# EAGLE design cpod (EAGLE 6.1)
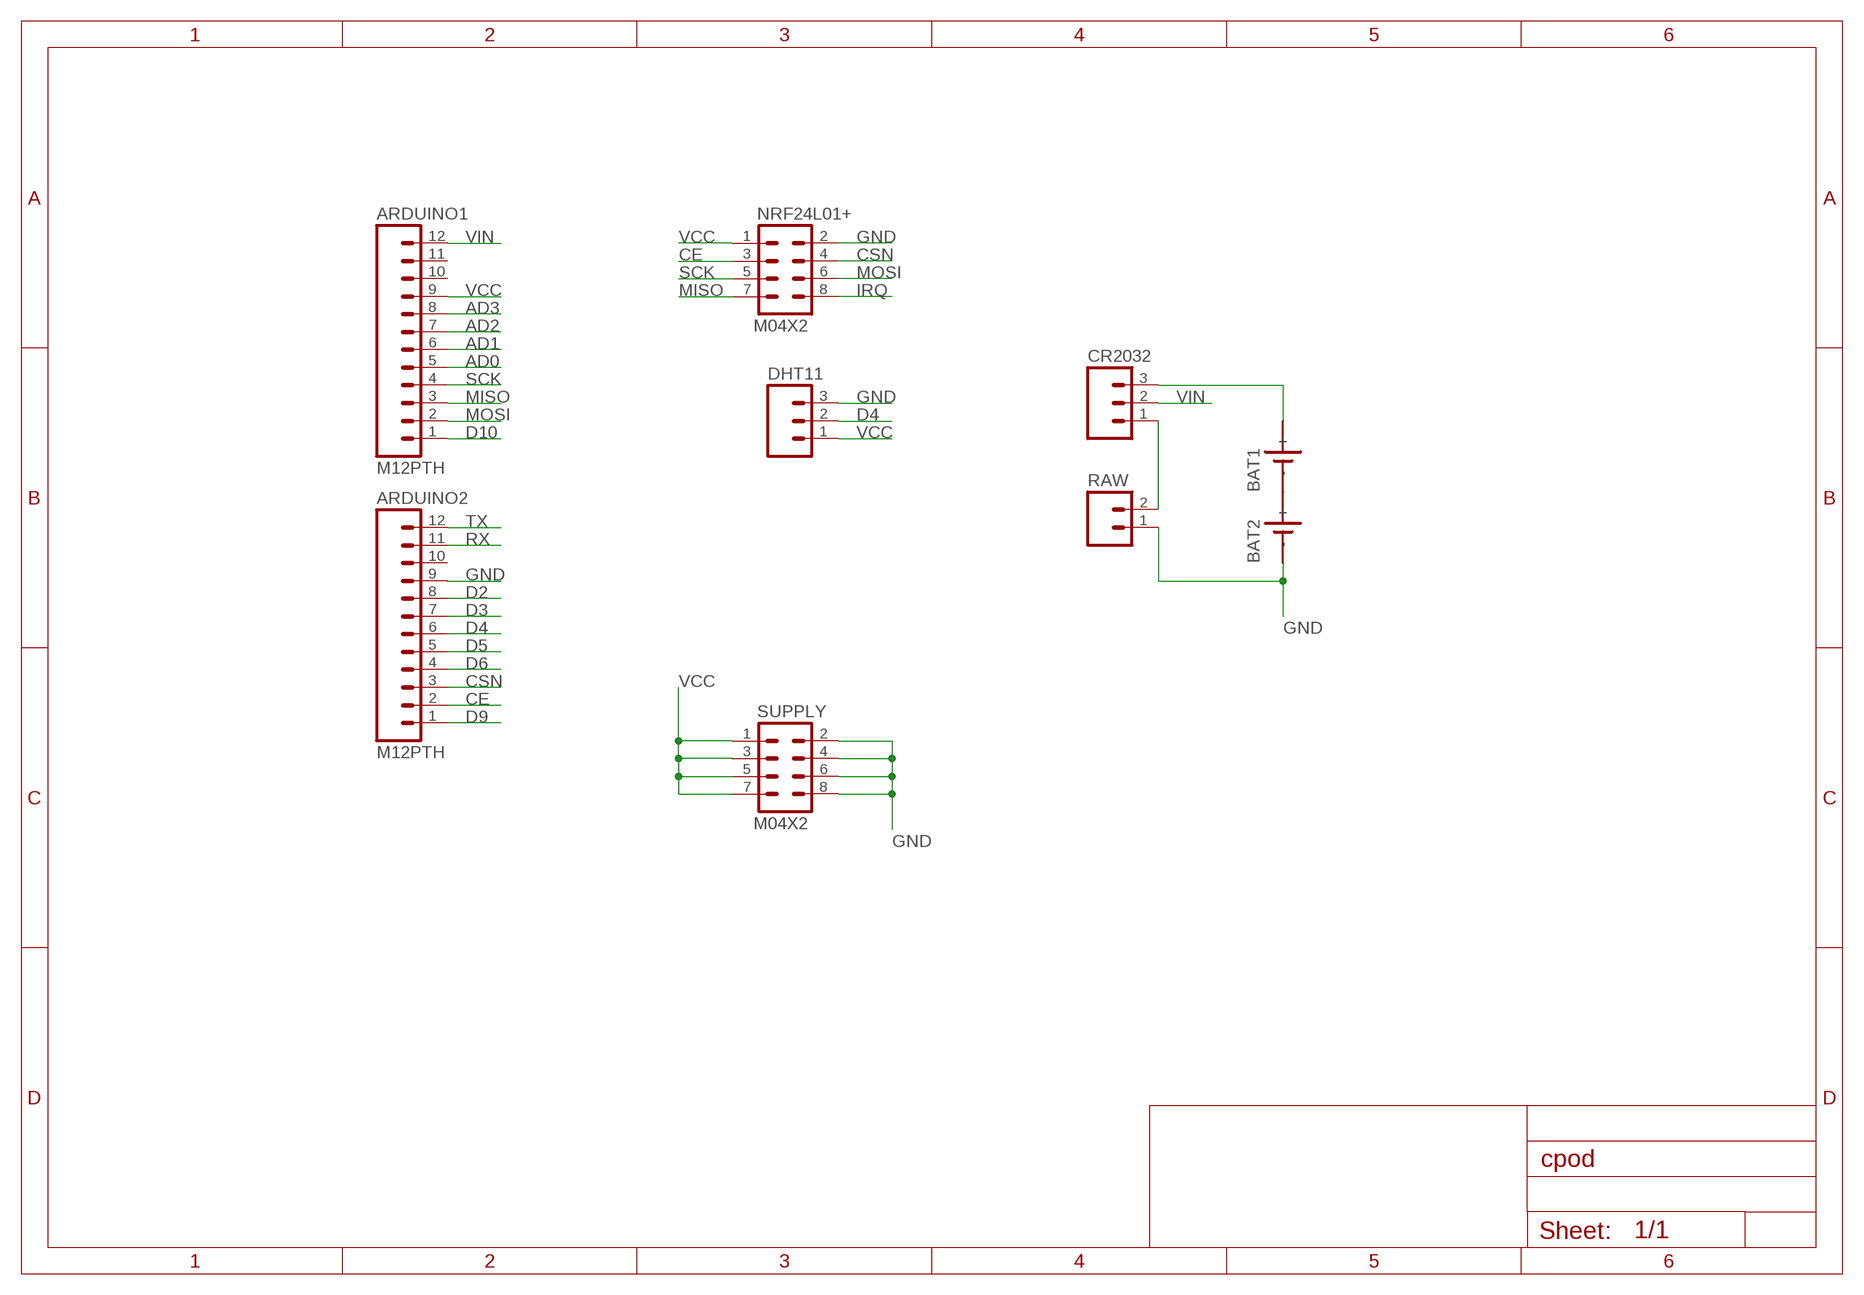
[diagram p0: schematic, sheet 1]

## Parts
ARDUINO1  M12PTH  [1X12]
ARDUINO2  M12PTH  [1X12]
BAT1  SN2032  [SN2032]
BAT2  SN2032  [SN2032]
CR2032  M03PTH  [1X03]
DHT11  M03PTH  [1X03]
NRF24L01+  M04X2  [2X4]
RAW  M02PTH  [1X02]
SUPPLY  M04X2  [2X4]

## Nets
AD0: ARDUINO1.5
AD1: ARDUINO1.6
AD2: ARDUINO1.7
AD3: ARDUINO1.8
CE: ARDUINO2.2 NRF24L01+.3
CSN: ARDUINO2.3 NRF24L01+.4
D2: ARDUINO2.8
D3: ARDUINO2.7
D4: ARDUINO2.6 DHT11.2
D5: ARDUINO2.5
D6: ARDUINO2.4
D9: ARDUINO2.1
D10: ARDUINO1.1
GND: ARDUINO2.9 BAT2.- DHT11.3 NRF24L01+.2 RAW.1 SUPPLY.2 SUPPLY.4 SUPPLY.6 SUPPLY.8
IRQ: NRF24L01+.8
MISO: ARDUINO1.3 NRF24L01+.7
MOSI: ARDUINO1.2 NRF24L01+.6
N$1: BAT1.- BAT2.+
N$2: BAT1.+ CR2032.3
N$3: CR2032.1 RAW.2
RX: ARDUINO2.11
SCK: ARDUINO1.4 NRF24L01+.5
TX: ARDUINO2.12
VCC: ARDUINO1.9 DHT11.1 NRF24L01+.1 SUPPLY.1 SUPPLY.3 SUPPLY.5 SUPPLY.7
VIN: ARDUINO1.12 CR2032.2
Unconnected: ARDUINO1.10 ARDUINO1.11 ARDUINO2.10

## Library data of the parts
ARDUINO1 ARDUINO2 = SparkFun-Connectors:M12: Header 12 Standard 12-pin 0.1" header. Use with straight break away headers (SKU : PRT-00116), right angle break away headers (PRT-00553), swiss pins (PRT-00743), machine pins (PRT-00117), and female headers (PRT-00115).
BAT1 BAT2 = sn2032:SN2032: LI BATTERY
CR2032 DHT11 = SparkFun-Connectors:M03: Header 3 Standard 3-pin 0.1" header. Use with straight break away headers (SKU : PRT-00116), right angle break away headers (PRT-00553), swiss pins (PRT-00743), machine pins (PRT-00117), and female headers (PRT-00115). Molex polarized connector foot print use with SKU : PRT-08232 with associated crimp pins and housings.
NRF24L01+ SUPPLY = SparkFun-Connectors:M04X2: .1" header, two rows of four.
RAW = SparkFun-Connectors:M02: Header 2 Standard 2-pin 0.1" header. Use with straight break away headers (SKU : PRT-00116), right angle break away headers (PRT-00553), swiss pins (PRT-00743), machine pins (PRT-00117), and female headers (PRT-00115). Molex polarized connector foot print use with SKU : PRT-08233 with associated crimp pins and housings.

## Board
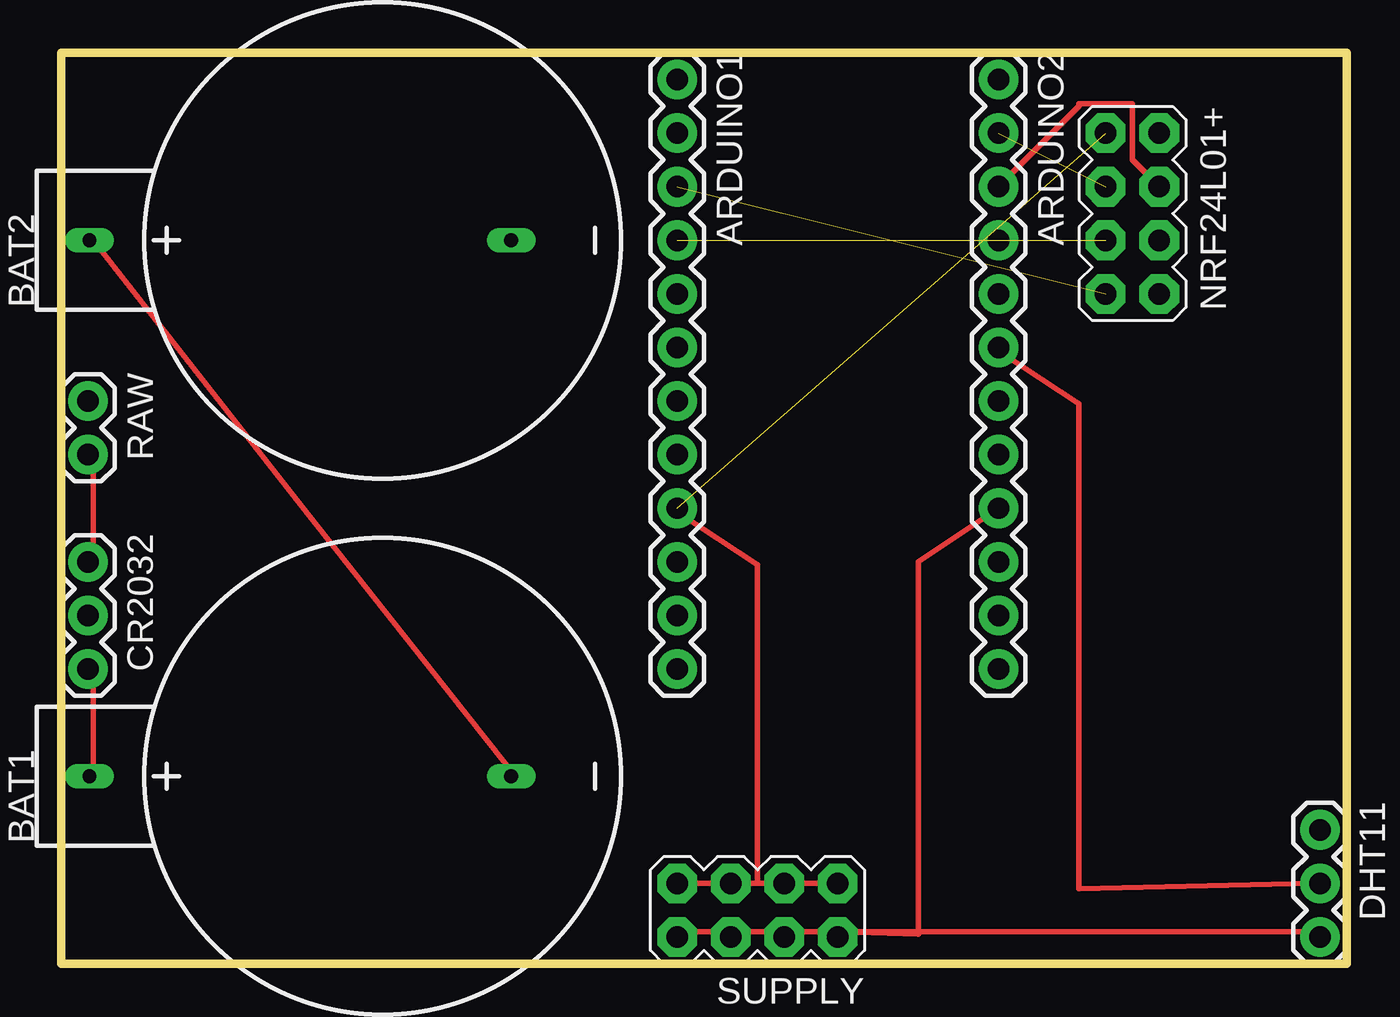
[diagram p1: board, top side]
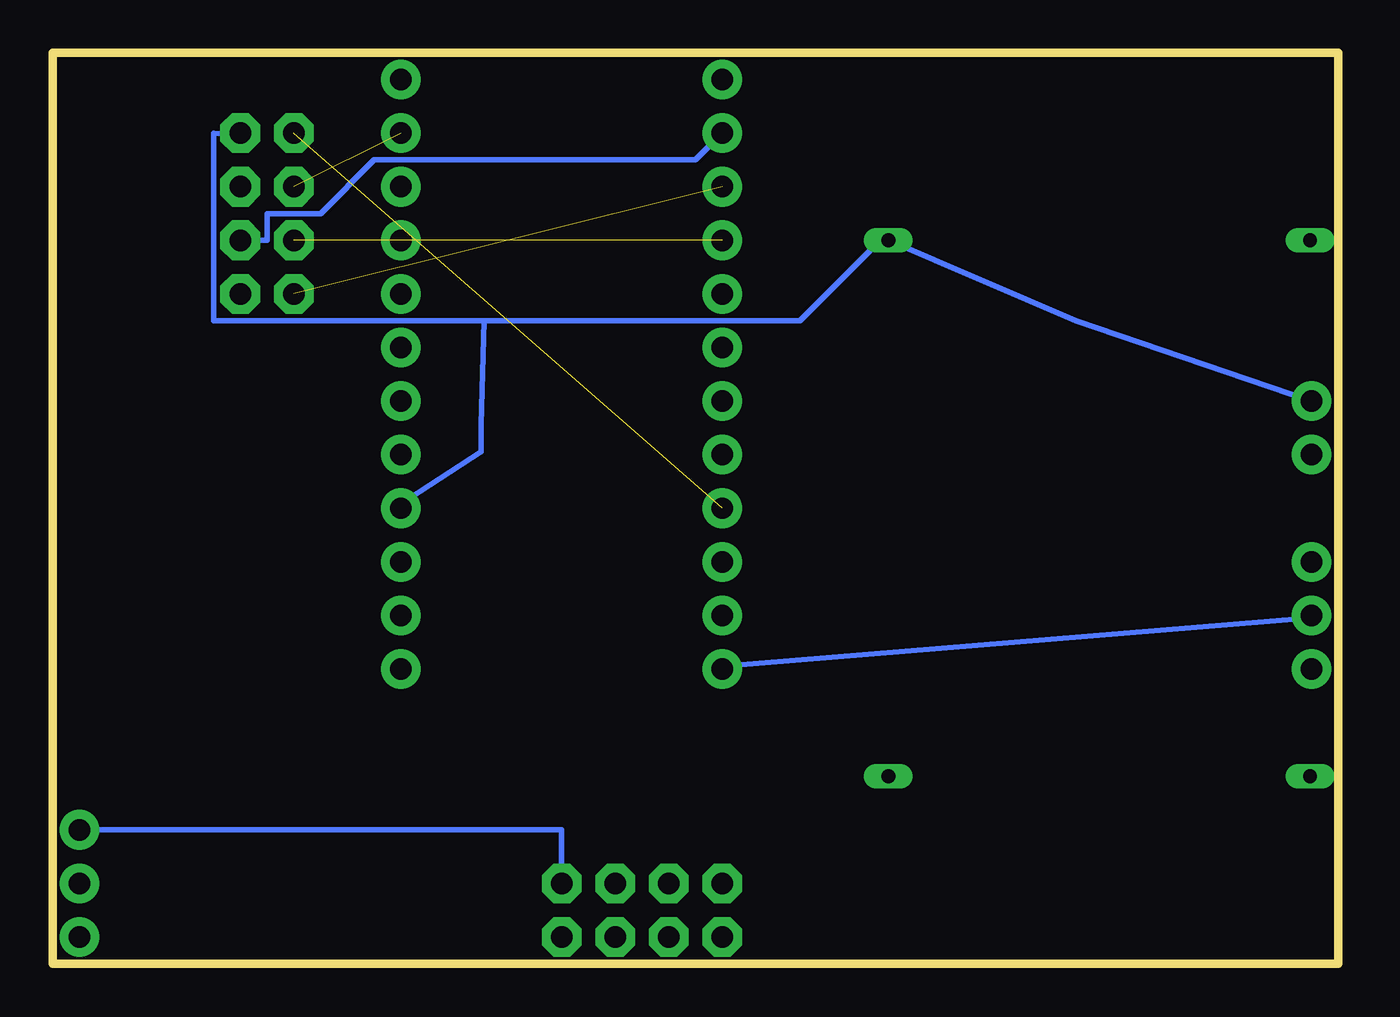
[diagram p2: board, bottom side, seen from below]

Size 60.96 x 43.18 mm. Coordinates in mm from the lower left corner, seen from the top.
Outline: 0,0 0,43.18 60.96,43.18 60.96,0 0,0
Copper layers (1*16): Top 0.035mm / dielectric 1.5mm / Bottom 0.035mm
Design rules: minimum track width 10mil, minimum drill 24mil, track to track 8mil, track to pad 8mil, pad to pad 8mil, via to via 8mil, smd to smd 8mil, copper to edge 40mil, drill to drill 8mil, minimum pad ring 10mil, minimum via ring 8mil, stop-mask expansion 4mil, vias tented up to drill 0mil, thermal gap 10mil

### Footprints (pad centres in the part's own frame; a part is rotated, then mirrored left to right if it is on the bottom)
1X12 = drill 1.016 pad 1.88: 1 0,0; 2 2.54,0; 3 5.08,0; 4 7.62,0; 5 10.16,0; 6 12.7,0; 7 15.24,0; 8 17.78,0; 9 20.32,0; 10 22.86,0; 11 25.4,0; 12 27.94,0
SN2032 = drill 0.65 long: + 0,13.9; - 0,-6.1
1X03 = drill 1.016 pad 1.88: 1 0,0; 2 2.54,0; 3 5.08,0
2X4 = drill 1.016 pad 1.88 octagon: 1 -3.81,-1.27; 2 -3.81,1.27; 3 -1.27,-1.27; 4 -1.27,1.27; 5 1.27,-1.27; 6 1.27,1.27; 7 3.81,-1.27; 8 3.81,1.27
1X02 = drill 1.016 pad 1.88: 1 0,0; 2 2.54,0

### Placement (x,y rotation side)
ARDUINO1  29.21,41.91 270 top
ARDUINO2  44.45,41.91 270 top
BAT1  15.24,8.89 90 top
BAT2  15.24,34.29 90 top
CR2032  1.27,19.05 270 top
DHT11  59.69,6.35 270 top
NRF24L01+  50.8,35.56 270 top
RAW  1.27,26.67 270 top
SUPPLY  33.02,2.54 180 top

### Tracks (layer width: path | path; a pad name or v marks a point on that pad's centre or on a via)
CE  (1 unrouted)
CSN
  Top 0.254: ARDUINO2.3 48.26,40.64 48.26,40.77 50.8,40.77 50.8,38.1 NRF24L01+.4
D4
  Top 0.254: DHT11.2 59.44,3.81 48.26,3.56 48.26,26.54 44.58,28.96 ARDUINO2.6
GND
  Top 0.254: SUPPLY.8 29.34,1.52 31.62,1.52 SUPPLY.6 32,1.52 34.29,1.52 | 34.29,1.52 36.58,1.52 SUPPLY.2 36.96,1.52 | 34.29,1.52 SUPPLY.4 | ARDUINO2.9 40.64,19.05 40.64,1.4 36.96,1.52 | 36.96,1.52 59.44,1.52 DHT11.3
  Bottom 0.254: RAW.1 12.45,30.48 BAT2.- 21.72,34.29 25.53,30.48 40.51,30.48 | 40.51,30.48 40.64,25.53 40.64,24.26 44.58,21.72 ARDUINO2.9 | 40.51,30.48 53.34,30.48 53.34,39.37 51.82,39.24 NRF24L01+.2
MISO  (1 unrouted)
MOSI
  Bottom 0.254: ARDUINO1.2 30.48,38.1 45.72,38.1 48.26,35.56 50.8,35.56 50.8,34.29 NRF24L01+.6
N$1
  Top 0.254: BAT1.- 21.34,9.14 11.68,21.34 1.52,34.29 BAT2.+
N$2
  Top 0.254: BAT1.+ 1.52,9.14 1.52,13.72 CR2032.3
N$3
  Top 0.254: CR2032.1 1.52,19.05 1.52,24 RAW.2
SCK  (1 unrouted)
VCC  (1 unrouted)
  Top 0.254: 33.02,3.81 SUPPLY.7 | 33.02,3.81 SUPPLY.3 SUPPLY.1 | 33.02,3.81 33.02,18.92 29.34,21.34 ARDUINO1.9
  Bottom 0.254: DHT11.1 36.83,6.35 SUPPLY.1
VIN
  Bottom 0.254: CR2032.2 1.52,16.38 29.21,14.1 28.96,14.1 ARDUINO1.12